# Altium schematic sheet 1_P1.schdoc
size 340 x 353 mm; Symbol: Sheet-Symbol_A4; Device: Sheet-Symbol_A4; Company: 嘉立创EDA; Version: V1.0; Page Size: A4; @Project Name: wheel_robot; @Page Count: 1; @Update Date: 2025-10-04; @Create Date: 2024-11-28; @Schematic Name: Schematic1; @Page No: 1; @Page Name: P1; @Board Name: CONTROL_STM32F407; @Create Time: 02:18:50; @Update Time: 21:44:46; Width: 1300; Height: 1350; Region Start: 1; X Region Count: 6; Y Region Count: 4; Blade Width: 10; Title Block Position: 3
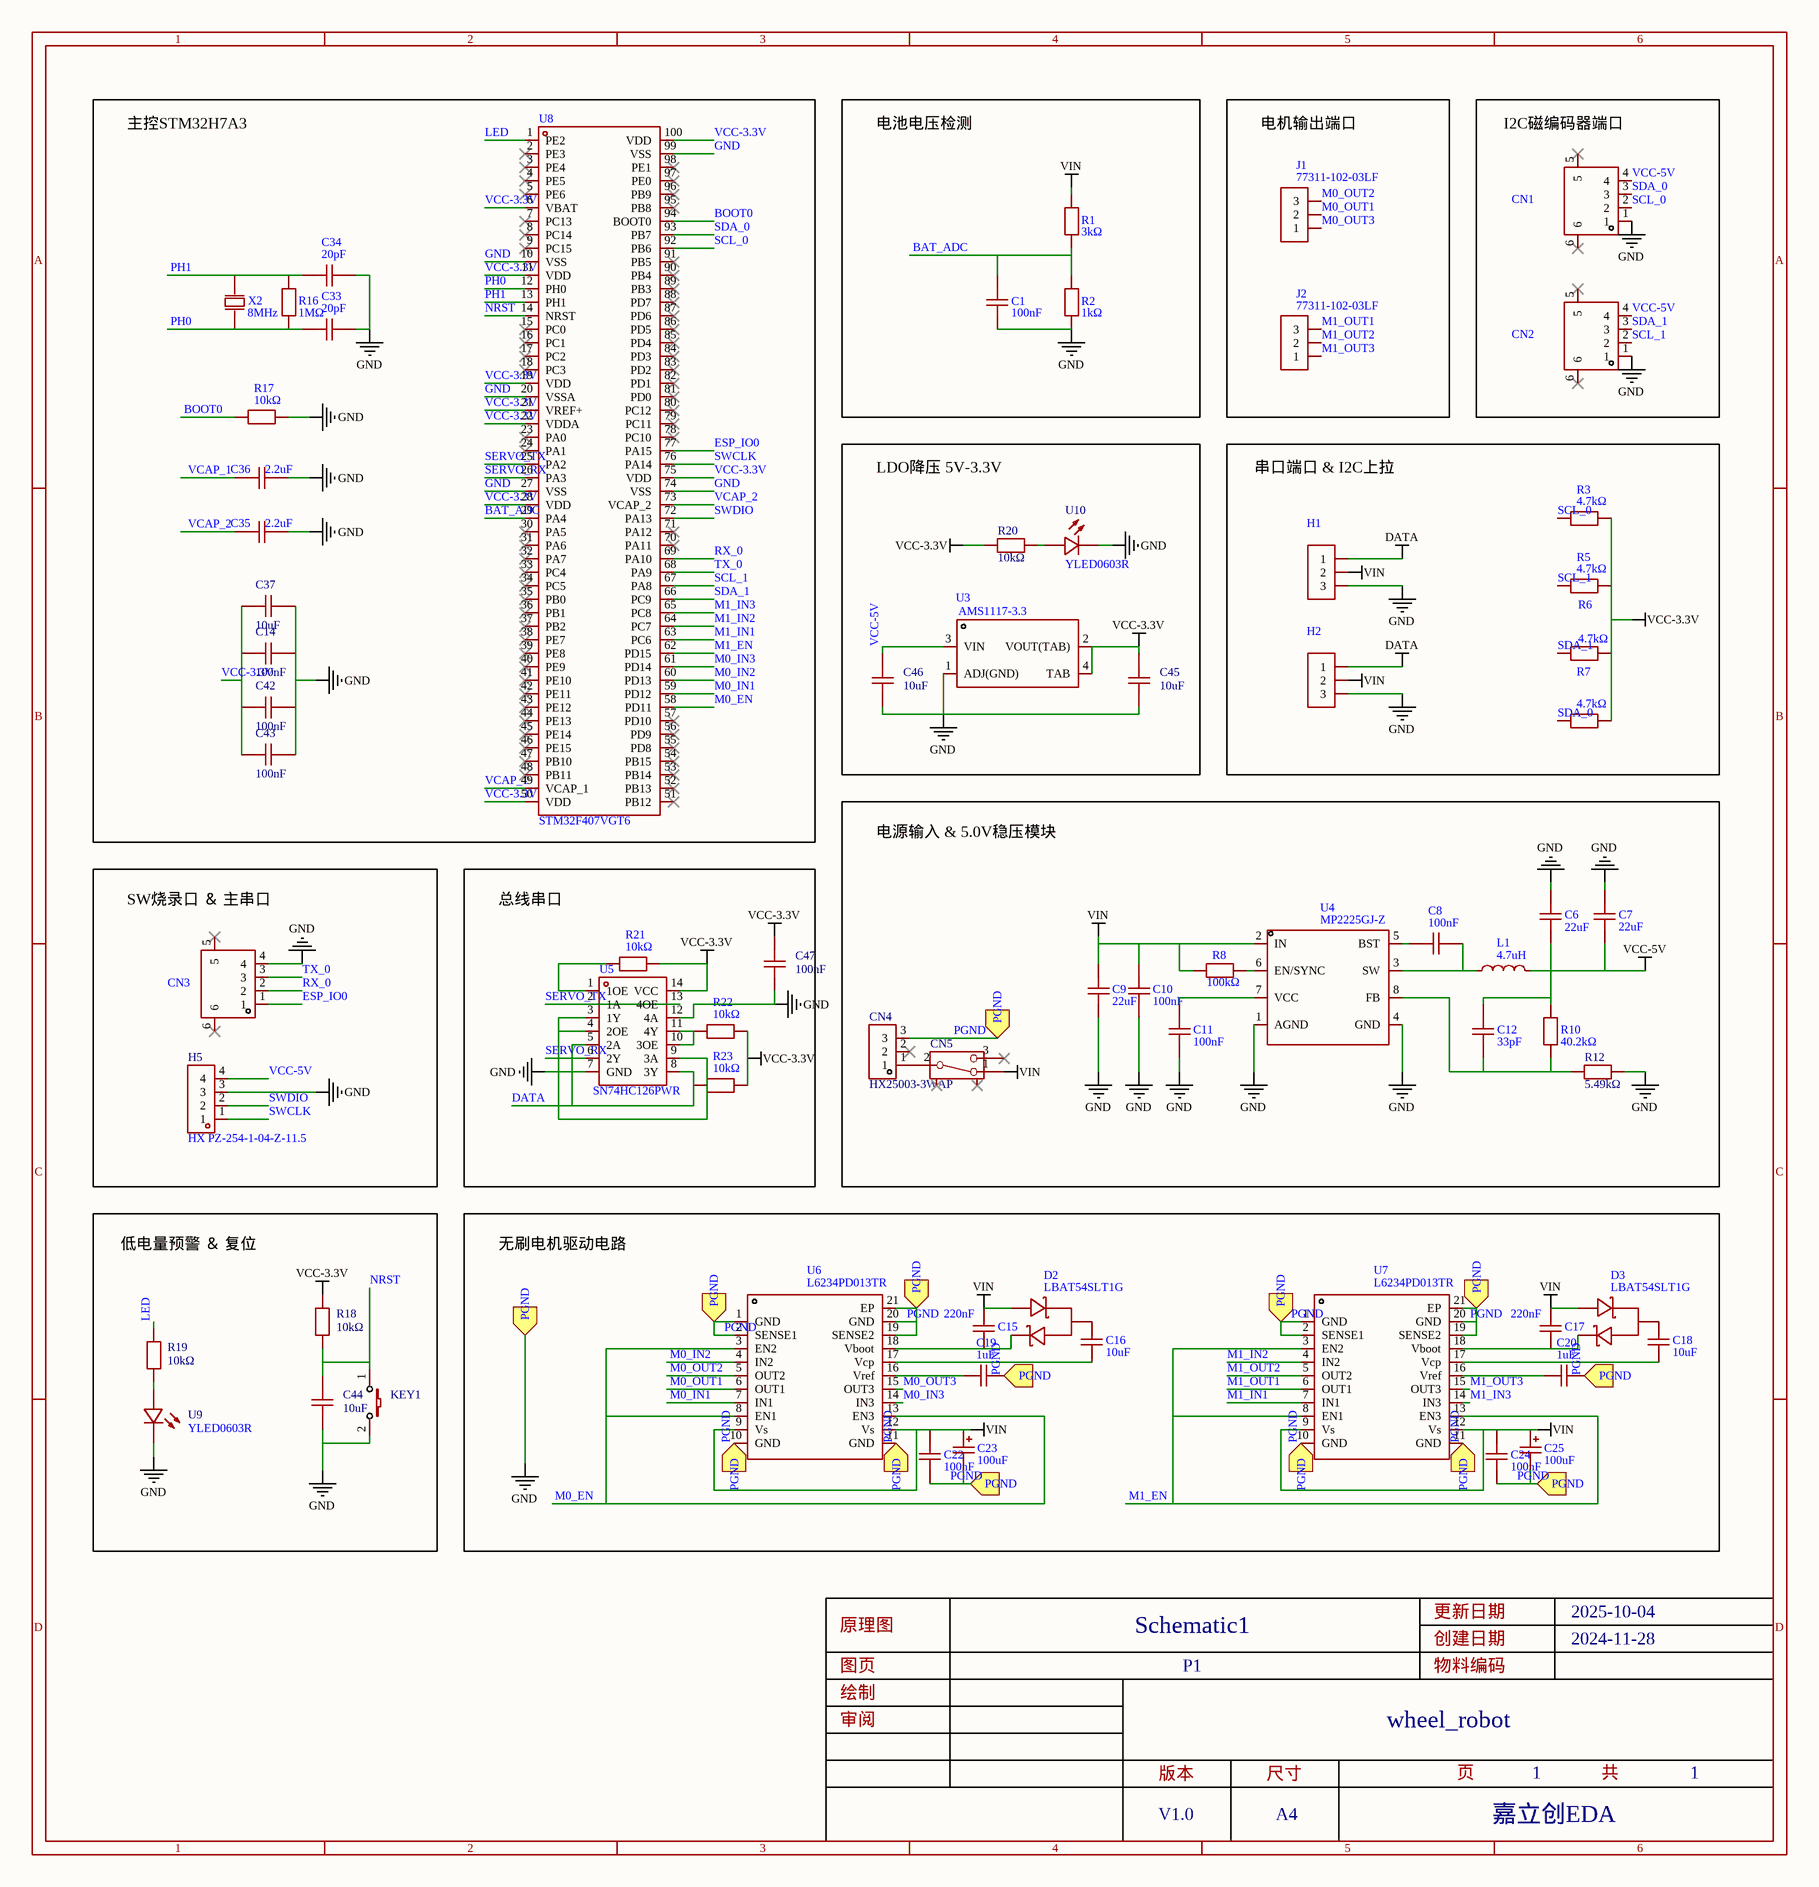
[diagram p0: 1_P1.schdoc]

## Parts
C1  100nF  [C0603]
C6  22uF  [C0603]
C7  22uF  [C0603]
C8  100nF  [C0603]
C9  22uF  [C0603]
C10  100nF  [C0603]
C11  100nF  [C0603]
C12  33pF  [C0603]
C14  100nF  [C0603]
C15  220nF  [C0603]
C16  10uF  [C0603]
C17  220nF  [C0603]
C18  10uF  [C0603]
C19  1uF  [C0603]
C20  1uF  [C0603]
C22  100nF  [C0603]
C23  100uF  [CAP-SMD_L7.3-W4.3-R-RD]
C24  100nF  [C0603]
C25  100uF  [CAP-SMD_L7.3-W4.3-R-RD]
C33  20pF  [C0603]
C34  20pF  [C0603]
C35  2.2uF  [C0603]
C36  2.2uF  [C0603]
C37  10uF  [C0603]
C42  100nF  [C0603]
C43  100nF  [C0603]
C44  10uF  [C0603]
C45  10uF  [C0603]
C46  10uF  [C0603]
C47  100nF  [C0603]
CN1  A1257WV-S-4P-LCP  [CONN-SMD_A1257WV-S-4P]  (value not drawn)
CN2  A1257WV-S-4P-LCP  [CONN-SMD_A1257WV-S-4P]  (value not drawn)
CN3  A1257WV-S-4P-LCP  [CONN-SMD_A1257WV-S-4P]  (value not drawn)
CN4  HX25003-3WAP  [CONN-TH_3P-P2.50_HX25003-3WAP]
CN5  SS-12D02-VG4  [SW-TH_SS-12D02-VG4]  (value not drawn)
D2  LBAT54SLT1G  [SOT-23_L2.9-W1.3-P1.90-LS2.4-BR]
D3  LBAT54SLT1G  [SOT-23_L2.9-W1.3-P1.90-LS2.4-BR]
H1  HC-5264-3AW  [CONN-TH_5264-3AW]  (value not drawn)
H2  HC-5264-3AW  [CONN-TH_5264-3AW]  (value not drawn)
H5  HX PZ-254-1-04-Z-11.5  [HDR-TH_4P-P2.54-V-M]
J1  77311-102-03LF  [HDR-M-2.54_1X3]
J2  77311-102-03LF  [HDR-M-2.54_1X3]
KEY1  K2-1107ST-A4DW-06  [KEY-SMD_2P-L6.2-W3.6-LS8.0]  (value not drawn)
L1  4.7uH  [IND-SMD_L7.3-W6.6]
R1  3kΩ  [R0603]
R2  1kΩ  [R0603]
R3  4.7kΩ  [R0603]
R5  4.7kΩ  [R0603]
R6  4.7kΩ  [R0603]
R7  4.7kΩ  [R0603]
R8  100kΩ  [R0603]
R10  40.2kΩ  [R0603]
R12  5.49kΩ  [R0603]
R16  1MΩ  [R0603]
R17  10kΩ  [R0603]
R18  10kΩ  [R0603]
R19  10kΩ  [R0603]
R20  10kΩ  [R0603]
R21  10kΩ  [R0603]
R22  10kΩ  [R0603]
R23  10kΩ  [R0603]
U3  AMS1117-3.3  [SOT-223_L6.7-W3.5-P2.30-BR]
U4  MP2225GJ-Z  [TSOT-23-8_L2.9-W1.6-P0.65-LS2.8-BR]
U5  SN74HC126PWR  [TSSOP-14_L5.0-W4.4-P0.65-LS6.4-BL]
U6  L6234PD013TR  [POWERSO20_L15.9-W11.0-P1.27-LS14.2-BL-EP]
U7  L6234PD013TR  [POWERSO20_L15.9-W11.0-P1.27-LS14.2-BL-EP]
U8  STM32F407VGT6  [LQFP-100_L14.0-W14.0-P0.50-LS16.0-BL]
U9  YLED0603R  [LED0603-FD]
U10  YLED0603R  [LED0603-FD]
X2  8MHz  [CRYSTAL-SMD_L5.0-W3.2]

## Blocks framed on the sheet
主控STM32H7A3: C14 C33-C37 C42 C43 R16 R17 U8 X2
电池电压检测: C1 R1 R2
电机输出端口: J1 J2
I2C磁编码器端口: CN1 CN2
LDO降压 5V-3.3V: C45 C46 R20 U3 U10
串口端口 & I2C上拉: H1 H2 R3 R5-R7
电源输入 & 5.0V稳压模块: C6-C12 CN4 CN5 L1 R8 R10 R12 U4
SW烧录口 ＆ 主串口: CN3 H5
总线串口: C47 R21-R23 U5
低电量预警 ＆ 复位: C44 KEY1 R18 R19 U9
无刷电机驱动电路: C15-C20 C22-C25 D2 D3 U6 U7

## Ports
PGND (in)

## Nets
DATA: H1.1 H2.1 R23.1 U5.5(2A) U5.8(3Y)
GND: C1.1 C6.1 C7.2 C9.1 C10.1 C11.1 C14.1 C19.2 C20.2 C22.1 C23.2 C24.1 C25.2 C33.2 C34.2 C35.2 C36.2 C37.1 C42.1 C43.1 C44.2 C45.2 C46.2 C47.2 CN1.1 CN2.1 CN3.4 CN4.3 H1.3 H2.3 H5.3 KEY1.2 R2.1 R12.1 R17.2 U3.1(ADJ(GND)) U4.1(AGND) U4.4(GND) U5.7(GND) U5.12(4A) U6.1(GND) U6.2(SENSE1) U6.10(GND) U6.11(GND) U6.19(SENSE2) U6.20(GND) U6.21(EP) U7.1(GND) U7.2(SENSE1) U7.10(GND) U7.11(GND) U7.19(SENSE2) U7.20(GND) U7.21(EP) U8.10(VSS) U8.20(VSSA) U8.27(VSS) U8.74(VSS) U8.99(VSS) U9.2(-) U10.2(-) ; port PGND  [also labelled PGND]
VCC-3.3V: C14.2 C37.2 C42.2 C43.2 C45.1 C47.1 R3.2 R5.2 R6.2 R7.2 R18.2 R20.2 R21.2 R22.2 R23.2 U3.2(VOUT(TAB)) U3.4(TAB) U5.14(VCC) U8.6(VBAT) U8.11(VDD) U8.19(VDD) U8.21(VREF+) U8.22(VDDA) U8.28(VDD) U8.50(VDD) U8.75(VDD) U8.100(VDD)
VCC-5V: C6.2 C7.1 C12.1 C46.1 CN1.4 CN2.4 H5.4 L1.2 R10.2 U3.3(VIN)
VIN: C9.2 C10.2 C15.1 C17.1 C22.2 C23.1 C24.2 C25.1 CN5.1 D2.1(A) D3.1(A) H1.2 H2.2 R1.2 R8.1 U4.2(IN) U6.9(Vs) U6.12(Vs) U7.9(Vs) U7.12(Vs)
BAT_ADC: C1.2 R1.1 R2.2 U8.29(PA4)
BOOT0: R17.1 U8.94(BOOT0)
ESP_IO0: CN3.1 U8.77(PA15)
LED: R19.2 U8.1(PE2)
M0_EN: U6.3(EN2) U6.8(EN1) U6.13(EN3) U8.58(PD11)
M0_IN1: U6.7(IN1) U8.59(PD12)
M0_IN2: U6.4(IN2) U8.60(PD13)
M0_IN3: U6.14(IN3) U8.61(PD14)
M0_OUT1: J1.2 U6.6(OUT1)
M0_OUT2: J1.3 U6.5(OUT2)
M0_OUT3: J1.1 U6.15(OUT3)
M1_EN: U7.3(EN2) U7.8(EN1) U7.13(EN3) U8.62(PD15)
M1_IN1: U7.7(IN1) U8.63(PC6)
M1_IN2: U7.4(IN2) U8.64(PC7)
M1_IN3: U7.14(IN3) U8.65(PC8)
M1_OUT1: J2.3 U7.6(OUT1)
M1_OUT2: J2.2 U7.5(OUT2)
M1_OUT3: J2.1 U7.15(OUT3)
NRST: C44.1 KEY1.1 R18.1 U8.14(NRST)
PH0: C33.1 R16.1 U8.12(PH0) X2.1(OSC1)
PH1: C34.1 R16.2 U8.13(PH1) X2.2(OSC2)
RX_0: CN3.2 U8.69(PA10)
SCL_0: CN1.2 R3.1 U8.92(PB6)
SCL_1: CN2.2 R5.1 U8.67(PA8)
SDA_0: CN1.3 R7.1 U8.93(PB7)
SDA_1: CN2.3 R6.1 U8.66(PC9)
SERVO_RX: U5.6(2Y) U8.26(PA3)
SERVO_TX: U5.2(1A) U5.13(4OE) U8.25(PA2)
SWCLK: H5.1 U8.76(PA14)
SWDIO: H5.2 U8.72(PA13)
TX_0: CN3.3 U8.68(PA9)
VCAP_1: C36.1 U8.49(VCAP_1)
VCAP_2: C35.1 U8.73(VCAP_2)
NetC8_1: C8.1 L1.1 U4.3(SW)
NetC8_2: C8.2 U4.5(BST)
NetC11_2: C11.2 U4.7(VCC)
NetC12_2: C12.2 R10.1 R12.2 U4.8(FB)
NetC15_2: C15.2 D2.2(K) U6.18(Vboot)
NetC16_1: C16.1 U6.17(Vcp)
NetC16_2: C16.2 D2.3(AK)
NetC17_2: C17.2 D3.2(K) U7.18(Vboot)
NetC18_1: C18.1 U7.17(Vcp)
NetC18_2: C18.2 D3.3(AK)
NetC19_1: C19.1 U6.16(Vref)
NetC20_1: C20.1 U7.16(Vref)
NetCN4_1: CN4.1 CN5.2
NetR8_2: R8.2 U4.6(EN/SYNC)
NetR19_1: R19.1 U9.1(+)
NetR20_1: R20.1 U10.1(+)
NetR21_1: R21.1 U5.1(1OE)
NetR22_1: R22.1 U5.10(3OE) U5.11(4Y)
NetU5_3: U5.3(1Y) U5.4(2OE) U5.9(3A)

Not connected (* = marked no-connect by the designer): CN1 5* 6*; CN2 5* 6*; CN3 5* 6*; CN4 2*; CN5 3* 4* 5*; U8 2(PE3)* 3(PE4)* 4(PE5)* 5(PE6)* 7(PC13)* 8(PC14)* 9(PC15)* 15(PC0)* 16(PC1)* 17(PC2)* 18(PC3)* 23(PA0)* 24(PA1)* 30(PA5)* 31(PA6)* 32(PA7)* 33(PC4)* 34(PC5)* 35(PB0)* 36(PB1)* 37(PB2)* 38(PE7)* 39(PE8)* 40(PE9)* 41(PE10)* 42(PE11)* 43(PE12)* 44(PE13)* 45(PE14)* 46(PE15)* 47(PB10)* 48(PB11)* 51(PB12)* 52(PB13)* 53(PB14)* 54(PB15)* 55(PD8)* 56(PD9)* 57(PD10)* 70(PA11)* 71(PA12)* 78(PC10)* 79(PC11)* 80(PC12)* 81(PD0)* 82(PD1)* 83(PD2)* 84(PD3)* 85(PD4)* 86(PD5)* 87(PD6)* 88(PD7)* 89(PB3)* 90(PB4)* 91(PB5)* 95(PB8)* 96(PB9)* 97(PE0)* 98(PE1)*

## Notes on the sheet
- 1
- 2
- 3
- 4
- 5
- 6
- A
- B
- C
- D
- 原理图
- Schematic1
- 创建日期
- 更新日期
- 2025-10-04
- 2024-11-28
- 绘制
- 图页
- P1
- 物料编码
- 审阅
- 版本
- 尺寸
- wheel_robot
- 页
- 共
- V1.0
- A4
- 嘉立创EDA

## Library data of the parts
C1 = CGA0603X7R104K500JT: Manufacturer: HRE(芯声); Symbol: 0.1uF; Add into BOM: yes; Tolerance: ±10%; Voltage Rated: 50V; Temperature Coefficient: X7R; Channel ID: $1e1331; Device: CGA0603X7R104K500JT; LCSC Part Name: 100nF ±10% 50V; Supplier Part: C6119867; Manufacturer Part: CGA0603X7R104K500JT; Supplier Footprint: 0603; JLCPCB Part Class: Extended Part; Supplier: LCSC; Convert to PCB: yes; Value: 100nF; FootprintName: C0603; DeviceName: CGA0603X7R104K500JT
C6 = CGA0603X5R226M160JT: Manufacturer: HRE(芯声); Add into BOM: yes; Tolerance: ±20%; Voltage Rating: 16V; Temperature Coefficient: X5R; Channel ID: $1e2697; Symbol: 22uF; Device: CGA0603X5R226M160JT; LCSC Part Name: 22uF ±20% 16V; Supplier Part: C6119868; Manufacturer Part: CGA0603X5R226M160JT; Supplier Footprint: 0603; JLCPCB Part Class: Extended Part; Datasheet: https://atta.szlcsc.com/upload/public/pdf/source/20250121/36E435B8815E1026A710792D223DB526.pdf; Supplier: LCSC; Convert to PCB: yes; Value: 22uF; FootprintName: C0603; DeviceName: CGA0603X5R226M160JT
C7 = CGA0603X5R226M160JT: Manufacturer: HRE(芯声); Add into BOM: yes; Tolerance: ±20%; Voltage Rating: 16V; Temperature Coefficient: X5R; Channel ID: $1e2759; Symbol: 22uF; Device: CGA0603X5R226M160JT; LCSC Part Name: 22uF ±20% 16V; Supplier Part: C6119868; Manufacturer Part: CGA0603X5R226M160JT; Supplier Footprint: 0603; JLCPCB Part Class: Extended Part; Datasheet: https://atta.szlcsc.com/upload/public/pdf/source/20250121/36E435B8815E1026A710792D223DB526.pdf; Supplier: LCSC; Convert to PCB: yes; Value: 22uF; FootprintName: C0603; DeviceName: CGA0603X5R226M160JT
C8 = CGA0603X7R104K500JT: Manufacturer: HRE(芯声); Symbol: 0.1uF; Add into BOM: yes; Tolerance: ±10%; Voltage Rated: 50V; Temperature Coefficient: X7R; Channel ID: $1e2723; Device: CGA0603X7R104K500JT; LCSC Part Name: 100nF ±10% 50V; Supplier Part: C6119867; Manufacturer Part: CGA0603X7R104K500JT; Supplier Footprint: 0603; JLCPCB Part Class: Extended Part; Supplier: LCSC; Convert to PCB: yes; Value: 100nF; FootprintName: C0603; DeviceName: CGA0603X7R104K500JT
C9 = CGA0603X5R226M160JT: Manufacturer: HRE(芯声); Add into BOM: yes; Tolerance: ±20%; Voltage Rating: 16V; Temperature Coefficient: X5R; Channel ID: $1e2569; Symbol: 22uF; Device: CGA0603X5R226M160JT; LCSC Part Name: 22uF ±20% 16V; Supplier Part: C6119868; Manufacturer Part: CGA0603X5R226M160JT; Supplier Footprint: 0603; JLCPCB Part Class: Extended Part; Datasheet: https://atta.szlcsc.com/upload/public/pdf/source/20250121/36E435B8815E1026A710792D223DB526.pdf; Supplier: LCSC; Convert to PCB: yes; Value: 22uF; FootprintName: C0603; DeviceName: CGA0603X5R226M160JT
C10 = CGA0603X7R104K500JT: Manufacturer: HRE(芯声); Symbol: 0.1uF; Add into BOM: yes; Tolerance: ±10%; Voltage Rated: 50V; Temperature Coefficient: X7R; Channel ID: $1e2595; Device: CGA0603X7R104K500JT; LCSC Part Name: 100nF ±10% 50V; Supplier Part: C6119867; Manufacturer Part: CGA0603X7R104K500JT; Supplier Footprint: 0603; JLCPCB Part Class: Extended Part; Supplier: LCSC; Convert to PCB: yes; Value: 100nF; FootprintName: C0603; DeviceName: CGA0603X7R104K500JT
C11 = CGA0603X7R104K500JT: Manufacturer: HRE(芯声); Symbol: 0.1uF; Add into BOM: yes; Tolerance: ±10%; Voltage Rated: 50V; Temperature Coefficient: X7R; Channel ID: $1e2641; Device: CGA0603X7R104K500JT; LCSC Part Name: 100nF ±10% 50V; Supplier Part: C6119867; Manufacturer Part: CGA0603X7R104K500JT; Supplier Footprint: 0603; JLCPCB Part Class: Extended Part; Supplier: LCSC; Convert to PCB: yes; Value: 100nF; FootprintName: C0603; DeviceName: CGA0603X7R104K500JT
C12 = CL10C330JB8NNNC: Manufacturer: SAMSUNG(三星); Add into BOM: yes; Tolerance: ±5%; Voltage Rated: 50V; Temperature Coefficient: C0G; Channel ID: $1e2805; Symbol: 33pF; Device: CL10C330JB8NNNC; LCSC Part Name: 33pF ±5% 50V; Supplier Part: C1663; Manufacturer Part: CL10C330JB8NNNC; Supplier Footprint: 0603; JLCPCB Part Class: Basic Part; Datasheet: https://atta.szlcsc.com/upload/public/pdf/source/20160218/1457707763339.pdf; Supplier: LCSC; Convert to PCB: yes; Value: 33pF; FootprintName: C0603; DeviceName: CL10C330JB8NNNC
C14 = CGA0603X7R104K500JT: Manufacturer: HRE(芯声); Symbol: 0.1u; Add into BOM: yes; Tolerance: ±10%; Voltage Rated: 50V; Temperature Coefficient: X7R; Channel ID: $1e29867; Device: CGA0603X7R104K500JT; LCSC Part Name: 100nF ±10% 50V; Supplier Part: C6119867; Manufacturer Part: CGA0603X7R104K500JT; Supplier Footprint: 0603; JLCPCB Part Class: Extended Part; Supplier: LCSC; Convert to PCB: yes; Value: 100nF; FootprintName: C0603; DeviceName: CGA0603X7R104K500JT
C15 = CL10B224KA8NNNC: Manufacturer: SAMSUNG(三星); Add into BOM: yes; Tolerance: ±10%; Voltage Rated: 25V; Temperature Coefficient: X7R; Channel ID: $1e1890; Symbol: 220nF; Device: CL10B224KA8NNNC; LCSC Part Name: 220nF ±10% 25V; Supplier Part: C21120; Manufacturer Part: CL10B224KA8NNNC; Supplier Footprint: 0603; JLCPCB Part Class: Basic Part; Datasheet: https://atta.szlcsc.com/upload/public/pdf/source/20160218/1457707763339.pdf; Supplier: LCSC; Convert to PCB: yes; Value: 220nF; FootprintName: C0603; DeviceName: CL10B224KA8NNNC
C16 = CGA0603X5R106K100JT: Manufacturer: HRE(芯声); Symbol: 10nF; Add into BOM: yes; Tolerance: ±10%; Voltage Rated: 10V; Temperature Coefficient: X5R; Channel ID: $1e1853; Device: CGA0603X5R106K100JT; LCSC Part Name: 10uF ±10% 10V; Supplier Part: C6119842; Manufacturer Part: CGA0603X5R106K100JT; Supplier Footprint: 0603; JLCPCB Part Class: Extended Part; Supplier: LCSC; Convert to PCB: yes; Value: 10uF; FootprintName: C0603; DeviceName: CGA0603X5R106K100JT
C17 = CL10B224KA8NNNC: Manufacturer: SAMSUNG(三星); Add into BOM: yes; Tolerance: ±10%; Voltage Rated: 25V; Temperature Coefficient: X7R; Channel ID: $1e1927; Symbol: 220nF; Device: CL10B224KA8NNNC; LCSC Part Name: 220nF ±10% 25V; Supplier Part: C21120; Manufacturer Part: CL10B224KA8NNNC; Supplier Footprint: 0603; JLCPCB Part Class: Basic Part; Datasheet: https://atta.szlcsc.com/upload/public/pdf/source/20160218/1457707763339.pdf; Supplier: LCSC; Convert to PCB: yes; Value: 220nF; FootprintName: C0603; DeviceName: CL10B224KA8NNNC
C18 = CGA0603X5R106K100JT: Manufacturer: HRE(芯声); Symbol: 10nF; Add into BOM: yes; Tolerance: ±10%; Voltage Rated: 10V; Temperature Coefficient: X5R; Channel ID: $1e1986; Device: CGA0603X5R106K100JT; LCSC Part Name: 10uF ±10% 10V; Supplier Part: C6119842; Manufacturer Part: CGA0603X5R106K100JT; Supplier Footprint: 0603; JLCPCB Part Class: Extended Part; Supplier: LCSC; Convert to PCB: yes; Value: 10uF; FootprintName: C0603; DeviceName: CGA0603X5R106K100JT
C19 = CGA0603X5R105K500JT: Manufacturer: HRE(芯声); Add into BOM: yes; Tolerance: ±10%; Voltage Rating: 50V; Temperature Coefficient: X5R; Channel ID: $1e1757; Symbol: 1uF; Device: CGA0603X5R105K500JT; LCSC Part Name: 1uF ±10% 50V; Supplier Part: C6119852; Manufacturer Part: CGA0603X5R105K500JT; Supplier Footprint: 0603; JLCPCB Part Class: Extended Part; Supplier: LCSC; Convert to PCB: yes; Value: 1uF; FootprintName: C0603; DeviceName: CGA0603X5R105K500JT
C20 = CGA0603X5R105K500JT: Manufacturer: HRE(芯声); Add into BOM: yes; Tolerance: ±10%; Voltage Rating: 50V; Temperature Coefficient: X5R; Channel ID: $1e1784; Symbol: 1uF; Device: CGA0603X5R105K500JT; LCSC Part Name: 1uF ±10% 50V; Supplier Part: C6119852; Manufacturer Part: CGA0603X5R105K500JT; Supplier Footprint: 0603; JLCPCB Part Class: Extended Part; Supplier: LCSC; Convert to PCB: yes; Value: 1uF; FootprintName: C0603; DeviceName: CGA0603X5R105K500JT
C22 = CGA0603X7R104K500JT: Manufacturer: HRE(芯声); Add into BOM: yes; Tolerance: ±10%; Voltage Rated: 50V; Temperature Coefficient: X7R; Channel ID: $1e2131; Symbol: 100nF; Device: CGA0603X7R104K500JT; LCSC Part Name: 100nF ±10% 50V; Supplier Part: C6119867; Manufacturer Part: CGA0603X7R104K500JT; Supplier Footprint: 0603; JLCPCB Part Class: Extended Part; Supplier: LCSC; Convert to PCB: yes; Value: 100nF; FootprintName: C0603; DeviceName: CGA0603X7R104K500JT
C23 = TAJD107M020RNJ: Manufacturer: Kyocera AVX; Add into BOM: yes; Tolerance: ±20%; Rated Voltage: 20V; Equivalent Series Resistance(ESR): 500mΩ@100kHz; Channel ID: $1e2285; Symbol: 100uF; Device: TAJD107M020RNJ; LCSC Part Name: 100uF ±20% 20V; Supplier Part: C99373; Manufacturer Part: TAJD107M020RNJ; Supplier Footprint: CASE-D-7343; JLCPCB Part Class: Extended Part; Datasheet: https://atta.szlcsc.com/upload/public/pdf/source/20180227/C182558_15197019548181370714.pdf; Supplier: LCSC; Convert to PCB: yes; Value: 100uF; Operating Temperature: -55℃~+125℃; FootprintName: CAP-SMD_L7.3-W4.3-R-RD; DeviceName: TAJD107M020RNJ
C24 = CGA0603X7R104K500JT: Manufacturer: HRE(芯声); Add into BOM: yes; Tolerance: ±10%; Voltage Rated: 50V; Temperature Coefficient: X7R; Channel ID: $1e2158; Symbol: 100nF; Device: CGA0603X7R104K500JT; LCSC Part Name: 100nF ±10% 50V; Supplier Part: C6119867; Manufacturer Part: CGA0603X7R104K500JT; Supplier Footprint: 0603; JLCPCB Part Class: Extended Part; Supplier: LCSC; Convert to PCB: yes; Value: 100nF; FootprintName: C0603; DeviceName: CGA0603X7R104K500JT
C25 = TAJD107M020RNJ: Manufacturer: Kyocera AVX; Add into BOM: yes; Tolerance: ±20%; Rated Voltage: 20V; Equivalent Series Resistance(ESR): 500mΩ@100kHz; Channel ID: $1e2312; Symbol: 100uF; Device: TAJD107M020RNJ; LCSC Part Name: 100uF ±20% 20V; Supplier Part: C99373; Manufacturer Part: TAJD107M020RNJ; Supplier Footprint: CASE-D-7343; JLCPCB Part Class: Extended Part; Datasheet: https://atta.szlcsc.com/upload/public/pdf/source/20180227/C182558_15197019548181370714.pdf; Supplier: LCSC; Convert to PCB: yes; Value: 100uF; Operating Temperature: -55℃~+125℃; FootprintName: CAP-SMD_L7.3-W4.3-R-RD; DeviceName: TAJD107M020RNJ
C33 = CC0603JRNPO9BN200: Manufacturer: YAGEO(国巨); Symbol: 20p; Add into BOM: yes; Tolerance: ±5%; Voltage Rated: 50V; Temperature Coefficient: NP0; Channel ID: $1e29413; Device: CC0603JRNPO9BN200; LCSC Part Name: 20pF ±5% 50V; Supplier Part: C105621; Manufacturer Part: CC0603JRNPO9BN200; Supplier Footprint: 0603; JLCPCB Part Class: Extended Part; Datasheet: https://atta.szlcsc.com/upload/public/pdf/source/20170505/1493957838062.pdf; Supplier: LCSC; Convert to PCB: yes; Value: 20pF; FootprintName: C0603; DeviceName: CC0603JRNPO9BN200
C34 = CC0603JRNPO9BN200: Manufacturer: YAGEO(国巨); Symbol: 20p; Add into BOM: yes; Tolerance: ±5%; Voltage Rated: 50V; Temperature Coefficient: NP0; Channel ID: $1e29436; Device: CC0603JRNPO9BN200; LCSC Part Name: 20pF ±5% 50V; Supplier Part: C105621; Manufacturer Part: CC0603JRNPO9BN200; Supplier Footprint: 0603; JLCPCB Part Class: Extended Part; Datasheet: https://atta.szlcsc.com/upload/public/pdf/source/20170505/1493957838062.pdf; Supplier: LCSC; Convert to PCB: yes; Value: 20pF; FootprintName: C0603; DeviceName: CC0603JRNPO9BN200
C35 = CL10A225KB8NNNC: Manufacturer: SAMSUNG(三星); Symbol: 10u; Add into BOM: yes; Tolerance: ±10%; Voltage Rated: 50V; Temperature Coefficient: X5R; Channel ID: $1e29770; Device: CL10A225KB8NNNC; LCSC Part Name: 2.2uF ±10% 50V; Supplier Part: C913904; Manufacturer Part: CL10A225KB8NNNC; Supplier Footprint: 0603; JLCPCB Part Class: Extended Part; Datasheet: https://atta.szlcsc.com/upload/public/pdf/source/20160218/1457707763339.pdf; Supplier: LCSC; Convert to PCB: yes; Value: 2.2uF; FootprintName: C0603; DeviceName: CL10A225KB8NNNC
C36 = CL10A225KB8NNNC: Manufacturer: SAMSUNG(三星); Symbol: 10u; Add into BOM: yes; Tolerance: ±10%; Voltage Rated: 50V; Temperature Coefficient: X5R; Channel ID: $1e29793; Device: CL10A225KB8NNNC; LCSC Part Name: 2.2uF ±10% 50V; Supplier Part: C913904; Manufacturer Part: CL10A225KB8NNNC; Supplier Footprint: 0603; JLCPCB Part Class: Extended Part; Datasheet: https://atta.szlcsc.com/upload/public/pdf/source/20160218/1457707763339.pdf; Supplier: LCSC; Convert to PCB: yes; Value: 2.2uF; FootprintName: C0603; DeviceName: CL10A225KB8NNNC
C37 = CGA0603X5R106K100JT: Manufacturer: HRE(芯声); Symbol: 10u; Add into BOM: yes; Tolerance: ±10%; Voltage Rated: 10V; Temperature Coefficient: X5R; Channel ID: $1e29824; Device: CGA0603X5R106K100JT; LCSC Part Name: 10uF ±10% 10V; Supplier Part: C6119842; Manufacturer Part: CGA0603X5R106K100JT; Supplier Footprint: 0603; JLCPCB Part Class: Extended Part; Supplier: LCSC; Convert to PCB: yes; Value: 10uF; FootprintName: C0603; DeviceName: CGA0603X5R106K100JT
C42 = CGA0603X7R104K500JT: Manufacturer: HRE(芯声); Symbol: 0.1u; Add into BOM: yes; Tolerance: ±10%; Voltage Rated: 50V; Temperature Coefficient: X7R; Channel ID: $1e29982; Device: CGA0603X7R104K500JT; LCSC Part Name: 100nF ±10% 50V; Supplier Part: C6119867; Manufacturer Part: CGA0603X7R104K500JT; Supplier Footprint: 0603; JLCPCB Part Class: Extended Part; Supplier: LCSC; Convert to PCB: yes; Value: 100nF; FootprintName: C0603; DeviceName: CGA0603X7R104K500JT
C43 = CGA0603X7R104K500JT: Manufacturer: HRE(芯声); Symbol: 0.1u; Add into BOM: yes; Tolerance: ±10%; Voltage Rated: 50V; Temperature Coefficient: X7R; Channel ID: $1e30005; Device: CGA0603X7R104K500JT; LCSC Part Name: 100nF ±10% 50V; Supplier Part: C6119867; Manufacturer Part: CGA0603X7R104K500JT; Supplier Footprint: 0603; JLCPCB Part Class: Extended Part; Supplier: LCSC; Convert to PCB: yes; Value: 100nF; FootprintName: C0603; DeviceName: CGA0603X7R104K500JT
C44 = CGA0603X5R106K100JT: Manufacturer: HRE(芯声); Symbol: 10u; Add into BOM: yes; Tolerance: ±10%; Voltage Rated: 10V; Temperature Coefficient: X5R; Channel ID: $1e30419; Device: CGA0603X5R106K100JT; LCSC Part Name: 10uF ±10% 10V; Supplier Part: C6119842; Manufacturer Part: CGA0603X5R106K100JT; Supplier Footprint: 0603; JLCPCB Part Class: Extended Part; Supplier: LCSC; Convert to PCB: yes; Value: 10uF; FootprintName: C0603; DeviceName: CGA0603X5R106K100JT
C45 = CGA0603X5R106K100JT: Manufacturer: HRE(芯声); Symbol: 10u; Add into BOM: yes; Tolerance: ±10%; Voltage Rated: 10V; Temperature Coefficient: X5R; Channel ID: $1e30669; Device: CGA0603X5R106K100JT; LCSC Part Name: 10uF ±10% 10V; Supplier Part: C6119842; Manufacturer Part: CGA0603X5R106K100JT; Supplier Footprint: 0603; JLCPCB Part Class: Extended Part; Supplier: LCSC; Convert to PCB: yes; Value: 10uF; FootprintName: C0603; DeviceName: CGA0603X5R106K100JT
C46 = CGA0603X5R106K100JT: Manufacturer: HRE(芯声); Symbol: 10u; Add into BOM: yes; Tolerance: ±10%; Voltage Rated: 10V; Temperature Coefficient: X5R; Channel ID: $1e30692; Device: CGA0603X5R106K100JT; LCSC Part Name: 10uF ±10% 10V; Supplier Part: C6119842; Manufacturer Part: CGA0603X5R106K100JT; Supplier Footprint: 0603; JLCPCB Part Class: Extended Part; Supplier: LCSC; Convert to PCB: yes; Value: 10uF; FootprintName: C0603; DeviceName: CGA0603X5R106K100JT
C47 = CGA0603X7R104K500JT: Manufacturer: HRE(芯声); Symbol: 0.1u; Add into BOM: yes; Tolerance: ±10%; Voltage Rated: 50V; Temperature Coefficient: X7R; Channel ID: $1e30860; Device: CGA0603X7R104K500JT; LCSC Part Name: 100nF ±10% 50V; Supplier Part: C6119867; Manufacturer Part: CGA0603X7R104K500JT; Supplier Footprint: 0603; JLCPCB Part Class: Extended Part; Supplier: LCSC; Convert to PCB: yes; Value: 100nF; FootprintName: C0603; DeviceName: CGA0603X7R104K500JT
CN1 = A1257WV-S-4P-LCP: Manufacturer: CJT(长江连接器); Add into BOM: yes; Pins Structure: 1x4P; Pitch: 1.25mm; Reference Series: GH; Number of PINs Per Row: 4; Channel ID: $1e1149; Symbol: A1257WV-S-4P; Device: A1257WV-S-4P-LCP; LCSC Part Name: 系列:GH 间距:1.25mm 1x4P; Supplier Part: C225120; Manufacturer Part: A1257WV-S-4P-LCP; Supplier Footprint: SMD,P=1.25mm; JLCPCB Part Class: Extended Part; Datasheet: https://atta.szlcsc.com/upload/public/pdf/source/20181008/C272994_C9E89FA8A36D0009CAD30AD8C59C2782.pdf; Supplier: LCSC; Convert to PCB: yes; Mounting Style: -; Number of Pins: 4P; Number of Rows: 1; Row Spacing: -; Contact Material: 黄铜; FootprintName: CONN-SMD_A1257WV-S-4P; DeviceName: A1257WV-S-4P-LCP
CN2 = A1257WV-S-4P-LCP: Manufacturer: CJT(长江连接器); Add into BOM: yes; Pins Structure: 1x4P; Pitch: 1.25mm; Reference Series: GH; Number of PINs Per Row: 4; Channel ID: $1e1190; Symbol: A1257WV-S-4P; Device: A1257WV-S-4P-LCP; LCSC Part Name: 系列:GH 间距:1.25mm 1x4P; Supplier Part: C225120; Manufacturer Part: A1257WV-S-4P-LCP; Supplier Footprint: SMD,P=1.25mm; JLCPCB Part Class: Extended Part; Datasheet: https://atta.szlcsc.com/upload/public/pdf/source/20181008/C272994_C9E89FA8A36D0009CAD30AD8C59C2782.pdf; Supplier: LCSC; Convert to PCB: yes; Mounting Style: -; Number of Pins: 4P; Number of Rows: 1; Row Spacing: -; Contact Material: 黄铜; FootprintName: CONN-SMD_A1257WV-S-4P; DeviceName: A1257WV-S-4P-LCP
CN3 = A1257WV-S-4P-LCP: Manufacturer: CJT(长江连接器); Add into BOM: yes; Pins Structure: 1x4P; Pitch: 1.25mm; Reference Series: GH; Number of PINs Per Row: 4; Channel ID: $1e19136; Symbol: A1257WV-S-4P; Device: A1257WV-S-4P-LCP; LCSC Part Name: 系列:GH 间距:1.25mm 1x4P; Supplier Part: C225120; Manufacturer Part: A1257WV-S-4P-LCP; Supplier Footprint: SMD,P=1.25mm; JLCPCB Part Class: Extended Part; Datasheet: https://atta.szlcsc.com/upload/public/pdf/source/20181008/C272994_C9E89FA8A36D0009CAD30AD8C59C2782.pdf; Supplier: LCSC; Convert to PCB: yes; Mounting Style: -; Number of Pins: 4P; Number of Rows: 1; Row Spacing: -; Contact Material: 黄铜; Origin Footprint: CONN-SMD_A1257WV-S-4P; FootprintName: CONN-SMD_A1257WV-S-4P; DeviceName: A1257WV-S-4P-LCP
CN4 = HX25003-3WAP: Manufacturer: HX(红星); Add into BOM: yes; Symbol: HX25003-3WAP; Device: HX25003-3WAP; Supplier: LCSC; Supplier Part: C442327; Manufacturer Part: HX25003-3WAP; JLCPCB Part Class: Extended Part; Convert to PCB: yes; Origin Footprint: CONN-TH_3P-P2.50_HX25003-3WAP
CN5 = SS-12D02-VG4_C136719: Manufacturer: 韩国韩荣; Add into BOM: yes; Circuit: 单刀双掷; Actuator Style: 矩形柱状; Pin Style: PC引脚; Switch Height: 8.7mm; Mechanical Life: 5千次; Channel ID: $1e3504; Symbol: SS-12D02-VG4; Device: SS-12D02-VG4_C136719; LCSC Part Name: 直插双档 滑动开关; Supplier Part: C136719; Manufacturer Part: SS-12D02-VG4; Supplier Footprint: 插件; JLCPCB Part Class: Extended Part; Datasheet: https://atta.szlcsc.com/upload/public/pdf/source/20171030/C136719_15093664985151068208.pdf; Supplier: LCSC; Convert to PCB: yes; Mounting Style: 直插; Current Rating (DC): -; Voltage Rating (DC): -; Current Rating (AC): -; Voltage Rating (AC): -; Operating Temperature: -25℃~+70℃; FootprintName: SW-TH_SS-12D02-VG4; DeviceName: SS-12D02-VG4_C136719
D2 = LBAT54SLT1G: Manufacturer: LRC(乐山无线电); Add into BOM: yes; Forward Voltage (Vf@If): 400mV; Reverse Voltage (Vr): 30V; Average Rectified Current (Io): 200mA; Reverse Leakage Current (Ir): 2uA; Channel ID: $1e1821; Symbol: LBAT54SLT1G; Device: LBAT54SLT1G; LCSC Part Name: 电压:30V 电流:200mA; Supplier Part: C12765; Manufacturer Part: LBAT54SLT1G; Supplier Footprint: SOT-23; JLCPCB Part Class: Extended Part; Datasheet: https://atta.szlcsc.com/upload/public/pdf/source/20130604/1457706606553.pdf; Supplier: LCSC; Convert to PCB: yes; FootprintName: SOT-23_L2.9-W1.3-P1.90-LS2.4-BR; DeviceName: LBAT54SLT1G
D3 = LBAT54SLT1G: Manufacturer: LRC(乐山无线电); Add into BOM: yes; Forward Voltage (Vf@If): 400mV; Reverse Voltage (Vr): 30V; Average Rectified Current (Io): 200mA; Reverse Leakage Current (Ir): 2uA; Channel ID: $1e1954; Symbol: LBAT54SLT1G; Device: LBAT54SLT1G; LCSC Part Name: 电压:30V 电流:200mA; Supplier Part: C12765; Manufacturer Part: LBAT54SLT1G; Supplier Footprint: SOT-23; JLCPCB Part Class: Extended Part; Datasheet: https://atta.szlcsc.com/upload/public/pdf/source/20130604/1457706606553.pdf; Supplier: LCSC; Convert to PCB: yes; FootprintName: SOT-23_L2.9-W1.3-P1.90-LS2.4-BR; DeviceName: LBAT54SLT1G
H1 = HC-5264-3AW: Manufacturer: HCTL(华灿天禄); Add into BOM: yes; Pins Structure: 1x3P; Pitch: 2.5mm; Reference Series: Mini-SPOX(5264); Number of PINs Per Row: 3; Current Rating (Max): 3A; Rated Voltage (Max): 250V; Plastic Material: PA66; Flame Retardant Rating: UL94V-0; Z-Height of the Board: 4.9mm; X-Length of Bottom Edge on Board (Spacing Line): 10mm; Y-Width of Bottom Edge on Board: 8mm; Channel ID: $1e3562; Standardization Check: false; Symbol: 5264-3A; Device: HC-5264-3AW; LCSC Part Name: 1x3P 间距:2.5mm 弯插 系列:Mini-SPOX(5264); Supplier Part: C2845826; Manufacturer Part: HC-5264-3AW; Supplier Footprint: 弯插,P=2.5mm; JLCPCB Part Class: Extended Part; Datasheet: https://atta.szlcsc.com/upload/public/pdf/source/20231019/7C36622803850C43F3C11A8612AA539D.pdf; Supplier: LCSC; Convert to PCB: yes; Mounting Style: 弯插; Number of Pins: 3P; Number of Rows: 1; Row Spacing: -; Contact Material: 黄铜; Contact Plating: 锡; Operating Temperature Range: -25℃~+85℃; Supplementary Features: -; Colour: -; FootprintName: CONN-TH_5264-3AW; DeviceName: HC-5264-3AW
H2 = HC-5264-3AW: Manufacturer: HCTL(华灿天禄); Add into BOM: yes; Pins Structure: 1x3P; Pitch: 2.5mm; Reference Series: Mini-SPOX(5264); Number of PINs Per Row: 3; Current Rating (Max): 3A; Rated Voltage (Max): 250V; Plastic Material: PA66; Flame Retardant Rating: UL94V-0; Z-Height of the Board: 4.9mm; X-Length of Bottom Edge on Board (Spacing Line): 10mm; Y-Width of Bottom Edge on Board: 8mm; Channel ID: $1e3612; Standardization Check: false; Symbol: 5264-3A; Device: HC-5264-3AW; LCSC Part Name: 1x3P 间距:2.5mm 弯插 系列:Mini-SPOX(5264); Supplier Part: C2845826; Manufacturer Part: HC-5264-3AW; Supplier Footprint: 弯插,P=2.5mm; JLCPCB Part Class: Extended Part; Datasheet: https://atta.szlcsc.com/upload/public/pdf/source/20231019/7C36622803850C43F3C11A8612AA539D.pdf; Supplier: LCSC; Convert to PCB: yes; Mounting Style: 弯插; Number of Pins: 3P; Number of Rows: 1; Row Spacing: -; Contact Material: 黄铜; Contact Plating: 锡; Operating Temperature Range: -25℃~+85℃; Supplementary Features: -; Colour: -; FootprintName: CONN-TH_5264-3AW; DeviceName: HC-5264-3AW
H5 = HX PZ-254-1-04-Z-11.5: Manufacturer: hanxia(韩下); Add into BOM: yes; Pin Structure: 1x4P; Pitch: 2.54mm; Circluar Pins/Square Pins: 方针; Current Rating (Max): 3A; Symbol: HX PZ-254-1-04-Z-11.5; Device: HX PZ-254-1-04-Z-11.5; LCSC Part Name: 2.54-1*4P直针公头 总高11.5 配套排母：HX PM2.54-1x4P系列; Supplier Part: C42391538; Manufacturer Part: HX PZ-254-1-04-Z-11.5; Supplier Footprint: 插件,P=2.54mm; Datasheet: https://atta.szlcsc.com/upload/public/pdf/source/20241120/7217712C20D40EE205DB74371EFB8B78.pdf; Supplier: LCSC; Convert to PCB: yes; Row Spacing: -; Mounting Type: 直插; Number of Rows: 单排; Number of Pins: 4P; Length of Mating Pin: 6mm; Insulation Height: 2.5mm; Length of End Connection Pin: 3mm; Contact Plating: 金; Operating Temperature Range: -40℃~+105℃; Color: 黑色
J1 = 77311-102-03LF: Manufacturer: Amphenol; Add into BOM: yes; Pitch: 2.54mm; Circluar Pins/Square Pins: 方针; Current Rating (Max): 3A; Channel ID: $1e1231; Symbol: HDR-M-2.54_1x3; Device: 77311-102-03LF; LCSC Part Name: 间距:2.54mm 直插 方针; Supplier Part: C180248; Manufacturer Part: 77311-102-03LF; Supplier Footprint: 插件,P=2.54mm; JLCPCB Part Class: Extended Part; Datasheet: https://atta.szlcsc.com/upload/public/pdf/source/20180628/C213450_5021AFFAB06BCF705334CA5527F304F1.pdf; Supplier: LCSC; Convert to PCB: yes; Pin Structure: -; Row Spacing: -; Mounting Type: 直插; Number of Rows: 单排; Number of Pins: 3P; Voltage Rating (Max): -; Length of Mating Pin: -; Insulation Height: 2.54mm; Contact Material: 磷青铜; Contact Plating: 锡; Operating Temperature Range: -65℃~+125℃; Color: 黑色; Origin Footprint: HDR-M-2.54_1X3; FootprintName: HDR-M-2.54_1X3; DeviceName: 77311-102-03LF
J2 = 77311-102-03LF: Manufacturer: Amphenol; Add into BOM: yes; Pitch: 2.54mm; Circluar Pins/Square Pins: 方针; Current Rating (Max): 3A; Channel ID: $1e1261; Symbol: HDR-M-2.54_1x3; Device: 77311-102-03LF; LCSC Part Name: 间距:2.54mm 直插 方针; Supplier Part: C180248; Manufacturer Part: 77311-102-03LF; Supplier Footprint: 插件,P=2.54mm; JLCPCB Part Class: Extended Part; Datasheet: https://atta.szlcsc.com/upload/public/pdf/source/20180628/C213450_5021AFFAB06BCF705334CA5527F304F1.pdf; Supplier: LCSC; Convert to PCB: yes; Pin Structure: -; Row Spacing: -; Mounting Type: 直插; Number of Rows: 单排; Number of Pins: 3P; Voltage Rating (Max): -; Length of Mating Pin: -; Insulation Height: 2.54mm; Contact Material: 磷青铜; Contact Plating: 锡; Operating Temperature Range: -65℃~+125℃; Color: 黑色; Origin Footprint: HDR-M-2.54_1X3; FootprintName: HDR-M-2.54_1X3; DeviceName: 77311-102-03LF
KEY1 = K2-1107ST-A4DW-06: Manufacturer: 韩国韩荣; Symbol: K2-3.6×6.1_SMD; Add into BOM: yes; Circuit: 单刀单掷; Actuator Style: 矩形按钮; Operating Force: 250gf; Switch Length: 6.1mm; Switch Width: 3.6mm; Switch Height: 2.5mm; Contact Current: 50mA; Voltage Rating (DC): 12V; Insulation Resistance: 100MΩ; Mechanical Life: 10万次; Channel ID: $1e16534; Standardization Check: false; Device: K2-1107ST-A4DW-06; LCSC Part Name: 轻触开关 3.6*6.1*2.5; Supplier Part: C118141; Manufacturer Part: K2-1107ST-A4DW-06; Supplier Footprint: SMD; JLCPCB Part Class: Extended Part; Datasheet: https://atta.szlcsc.com/upload/public/pdf/source/20210810/381712CEF248770C072B585C3485C888.pdf; Supplier: LCSC; Convert to PCB: yes; Mounting Style: 立贴; With Lamp: -; Operating Temperature: -25℃~+85℃; FootprintName: KEY-SMD_2P-L6.2-W3.6-LS8.0; DeviceName: K2-1107ST-A4DW-06
L1 = 4.7uH: Manufacturer: PSA(信昌电陶); Manufacturer Part: MCS0630-4R7MPY1; Add into BOM: yes; Symbol: 4.7uH; Device: 4.7uH; Supplier: LCSC; Supplier Part: C2937097; Convert to PCB: yes; Origin Footprint: IND-SMD_L7.3-W6.6
R1 = 0603WAF3001T5E: Manufacturer: UNI-ROYAL(厚声); Symbol: 3K/0.1%; Add into BOM: yes; Tolerance: ±1%; Power(Watts): 100mW; Overload Voltage (Max): 75V; Temperature Coefficient: ±100ppm/℃; Channel ID: $1e1357; Device: 0603WAF3001T5E; LCSC Part Name: 3kΩ ±1% 100mW 厚膜电阻; Supplier Part: C4211; Manufacturer Part: 0603WAF3001T5E; Supplier Footprint: 0603; JLCPCB Part Class: Basic Part; Datasheet: https://atta.szlcsc.com/upload/public/pdf/source/20200306/C422600_1E6D84923E4A46A82E41ADD87F860B5C.pdf; Supplier: LCSC; Convert to PCB: yes; Type: 厚膜电阻; Value: 3kΩ; Operating Temperature Range: -55℃~+155℃; FootprintName: R0603; DeviceName: 0603WAF3001T5E
R2 = 0603WAF1001T5E: Manufacturer: UNI-ROYAL(厚声); Symbol: 1k/0.1%; Add into BOM: yes; Tolerance: ±1%; Power(Watts): 100mW; Overload Voltage (Max): 75V; Temperature Coefficient: ±100ppm/℃; Channel ID: $1e1383; Device: 0603WAF1001T5E; LCSC Part Name: 1kΩ ±1% 100mW 厚膜电阻; Supplier Part: C21190; Manufacturer Part: 0603WAF1001T5E; Supplier Footprint: 0603; JLCPCB Part Class: Basic Part; Datasheet: https://atta.szlcsc.com/upload/public/pdf/source/20200306/C422600_1E6D84923E4A46A82E41ADD87F860B5C.pdf; Supplier: LCSC; Convert to PCB: yes; Type: 厚膜电阻; Value: 1kΩ; Operating Temperature Range: -55℃~+155℃; FootprintName: R0603; DeviceName: 0603WAF1001T5E
R3 = 0603WAF4701T5E: Manufacturer: UNI-ROYAL(厚声); Symbol: 4.7K; Add into BOM: yes; Tolerance: ±1%; Power(Watts): 100mW; Overload Voltage (Max): 75V; Temperature Coefficient: ±100ppm/℃; Channel ID: $1e2339; Device: 0603WAF4701T5E; LCSC Part Name: 4.7kΩ ±1% 100mW 厚膜电阻; Supplier Part: C23162; Manufacturer Part: 0603WAF4701T5E; Supplier Footprint: 0603; JLCPCB Part Class: Basic Part; Datasheet: https://atta.szlcsc.com/upload/public/pdf/source/20200306/C422600_1E6D84923E4A46A82E41ADD87F860B5C.pdf; Supplier: LCSC; Convert to PCB: yes; Type: 厚膜电阻; Value: 4.7kΩ; Operating Temperature Range: -55℃~+155℃; FootprintName: R0603; DeviceName: 0603WAF4701T5E
R5 = 0603WAF4701T5E: Manufacturer: UNI-ROYAL(厚声); Symbol: 4.7K; Add into BOM: yes; Tolerance: ±1%; Power(Watts): 100mW; Overload Voltage (Max): 75V; Temperature Coefficient: ±100ppm/℃; Channel ID: $1e2364; Device: 0603WAF4701T5E; LCSC Part Name: 4.7kΩ ±1% 100mW 厚膜电阻; Supplier Part: C23162; Manufacturer Part: 0603WAF4701T5E; Supplier Footprint: 0603; JLCPCB Part Class: Basic Part; Datasheet: https://atta.szlcsc.com/upload/public/pdf/source/20200306/C422600_1E6D84923E4A46A82E41ADD87F860B5C.pdf; Supplier: LCSC; Convert to PCB: yes; Type: 厚膜电阻; Value: 4.7kΩ; Operating Temperature Range: -55℃~+155℃; FootprintName: R0603; DeviceName: 0603WAF4701T5E
R6 = 0603WAF4701T5E: Manufacturer: UNI-ROYAL(厚声); Symbol: 4.7K; Add into BOM: yes; Tolerance: ±1%; Power(Watts): 100mW; Overload Voltage (Max): 75V; Temperature Coefficient: ±100ppm/℃; Channel ID: $1e2389; Device: 0603WAF4701T5E; LCSC Part Name: 4.7kΩ ±1% 100mW 厚膜电阻; Supplier Part: C23162; Manufacturer Part: 0603WAF4701T5E; Supplier Footprint: 0603; JLCPCB Part Class: Basic Part; Datasheet: https://atta.szlcsc.com/upload/public/pdf/source/20200306/C422600_1E6D84923E4A46A82E41ADD87F860B5C.pdf; Supplier: LCSC; Convert to PCB: yes; Type: 厚膜电阻; Value: 4.7kΩ; Operating Temperature Range: -55℃~+155℃; FootprintName: R0603; DeviceName: 0603WAF4701T5E
R7 = 0603WAF4701T5E: Manufacturer: UNI-ROYAL(厚声); Symbol: 4.7K; Add into BOM: yes; Tolerance: ±1%; Power(Watts): 100mW; Overload Voltage (Max): 75V; Temperature Coefficient: ±100ppm/℃; Channel ID: $1e2414; Device: 0603WAF4701T5E; LCSC Part Name: 4.7kΩ ±1% 100mW 厚膜电阻; Supplier Part: C23162; Manufacturer Part: 0603WAF4701T5E; Supplier Footprint: 0603; JLCPCB Part Class: Basic Part; Datasheet: https://atta.szlcsc.com/upload/public/pdf/source/20200306/C422600_1E6D84923E4A46A82E41ADD87F860B5C.pdf; Supplier: LCSC; Convert to PCB: yes; Type: 厚膜电阻; Value: 4.7kΩ; Operating Temperature Range: -55℃~+155℃; FootprintName: R0603; DeviceName: 0603WAF4701T5E
R8 = 0603WAF1003T5E: Manufacturer: UNI-ROYAL(厚声); Symbol: 100k; Add into BOM: yes; Tolerance: ±1%; Power(Watts): 100mW; Overload Voltage (Max): 75V; Temperature Coefficient: ±100ppm/℃; Channel ID: $1e2544; Device: 0603WAF1003T5E; LCSC Part Name: 100kΩ ±1% 100mW 厚膜电阻; Supplier Part: C25803; Manufacturer Part: 0603WAF1003T5E; Supplier Footprint: 0603; JLCPCB Part Class: Basic Part; Datasheet: https://atta.szlcsc.com/upload/public/pdf/source/20200306/C422600_1E6D84923E4A46A82E41ADD87F860B5C.pdf; Supplier: LCSC; Convert to PCB: yes; Type: 厚膜电阻; Value: 100kΩ; Operating Temperature Range: -55℃~+155℃; FootprintName: R0603; DeviceName: 0603WAF1003T5E
R10 = FRC0603F4022TS: Manufacturer: FOJAN(富捷); Symbol: 40.2k; Add into BOM: yes; Tolerance: ±1%; Power(Watts): 100mW; Overload Voltage (Max): 75V; Temperature Coefficient: ±100ppm/℃; Channel ID: $1e2830; Device: FRC0603F4022TS; LCSC Part Name: 40.2kΩ ±1% 100mW 厚膜电阻; Supplier Part: C2933218; Manufacturer Part: FRC0603F4022TS; Supplier Footprint: 0603; JLCPCB Part Class: Extended Part; Datasheet: https://atta.szlcsc.com/upload/public/pdf/source/20211221/925EC7D7225764EE0046F22065062C87.pdf; Supplier: LCSC; Convert to PCB: yes; Type: 厚膜电阻; Value: 40.2kΩ; Operating Temperature Range: -55℃~+155℃; FootprintName: R0603; DeviceName: FRC0603F4022TS
R12 = FRC0603F5491TS: Manufacturer: FOJAN(富捷); Symbol: 5.49k; Add into BOM: yes; Tolerance: ±1%; Power(Watts): 100mW; Overload Voltage (Max): 75V; Temperature Coefficient: ±100ppm/℃; Channel ID: $1e2855; Device: FRC0603F5491TS; LCSC Part Name: 5.49kΩ ±1% 100mW 厚膜电阻; Supplier Part: C3000723; Manufacturer Part: FRC0603F5491TS; Supplier Footprint: 0603; JLCPCB Part Class: Extended Part; Datasheet: https://atta.szlcsc.com/upload/public/pdf/source/20211221/925EC7D7225764EE0046F22065062C87.pdf; Supplier: LCSC; Convert to PCB: yes; Type: 厚膜电阻; Value: 5.49kΩ; FootprintName: R0603; DeviceName: FRC0603F5491TS
R16 = 0603WAF1004T5E: Manufacturer: UNI-ROYAL(厚声); Symbol: 1M; Add into BOM: yes; Tolerance: ±1%; Power(Watts): 100mW; Overload Voltage (Max): 75V; Temperature Coefficient: ±100ppm/℃; Channel ID: $1e29469; Device: 0603WAF1004T5E; LCSC Part Name: 1MΩ ±1% 100mW 厚膜电阻; Supplier Part: C22935; Manufacturer Part: 0603WAF1004T5E; Supplier Footprint: 0603; JLCPCB Part Class: Basic Part; Datasheet: https://atta.szlcsc.com/upload/public/pdf/source/20200306/C422600_1E6D84923E4A46A82E41ADD87F860B5C.pdf; Supplier: LCSC; Convert to PCB: yes; Type: 厚膜电阻; Value: 1MΩ; Operating Temperature Range: -55℃~+155℃; FootprintName: R0603; DeviceName: 0603WAF1004T5E
R17 = 0603WAF1002T5E: Manufacturer: UNI-ROYAL(厚声); Symbol: 10k; Add into BOM: yes; Tolerance: ±1%; Power(Watts): 100mW; Overload Voltage (Max): 75V; Temperature Coefficient: ±100ppm/℃; Channel ID: $1e29713; Device: 0603WAF1002T5E; LCSC Part Name: 厚膜电阻 10kΩ ±1% 100mW; Supplier Part: C25804; Manufacturer Part: 0603WAF1002T5E; Supplier Footprint: 0603; JLCPCB Part Class: Basic Part; Datasheet: https://atta.szlcsc.com/upload/public/pdf/source/20200306/C422600_1E6D84923E4A46A82E41ADD87F860B5C.pdf; Supplier: LCSC; Convert to PCB: yes; Type: 厚膜电阻; Value: 10kΩ; Operating Temperature Range: -55℃~+155℃; FootprintName: R0603; DeviceName: 0603WAF1002T5E
R18 = 0603WAF1002T5E: Manufacturer: UNI-ROYAL(厚声); Symbol: 10k; Add into BOM: yes; Tolerance: ±1%; Power(Watts): 100mW; Overload Voltage (Max): 75V; Temperature Coefficient: ±100ppm/℃; Channel ID: $1e30442; Device: 0603WAF1002T5E; LCSC Part Name: 厚膜电阻 10kΩ ±1% 100mW; Supplier Part: C25804; Manufacturer Part: 0603WAF1002T5E; Supplier Footprint: 0603; JLCPCB Part Class: Basic Part; Datasheet: https://atta.szlcsc.com/upload/public/pdf/source/20200306/C422600_1E6D84923E4A46A82E41ADD87F860B5C.pdf; Supplier: LCSC; Convert to PCB: yes; Type: 厚膜电阻; Value: 10kΩ; Operating Temperature Range: -55℃~+155℃; FootprintName: R0603; DeviceName: 0603WAF1002T5E
R19 = 0603WAF1002T5E: Manufacturer: UNI-ROYAL(厚声); Symbol: 10k; Add into BOM: yes; Tolerance: ±1%; Power(Watts): 100mW; Overload Voltage (Max): 75V; Temperature Coefficient: ±100ppm/℃; Channel ID: $1e30468; Device: 0603WAF1002T5E; LCSC Part Name: 厚膜电阻 10kΩ ±1% 100mW; Supplier Part: C25804; Manufacturer Part: 0603WAF1002T5E; Supplier Footprint: 0603; JLCPCB Part Class: Basic Part; Datasheet: https://atta.szlcsc.com/upload/public/pdf/source/20200306/C422600_1E6D84923E4A46A82E41ADD87F860B5C.pdf; Supplier: LCSC; Convert to PCB: yes; Type: 厚膜电阻; Value: 10kΩ; Operating Temperature Range: -55℃~+155℃; FootprintName: R0603; DeviceName: 0603WAF1002T5E
R20 = 0603WAF1002T5E: Manufacturer: UNI-ROYAL(厚声); Symbol: 10k; Add into BOM: yes; Tolerance: ±1%; Power(Watts): 100mW; Overload Voltage (Max): 75V; Temperature Coefficient: ±100ppm/℃; Channel ID: $1e30587; Device: 0603WAF1002T5E; LCSC Part Name: 厚膜电阻 10kΩ ±1% 100mW; Supplier Part: C25804; Manufacturer Part: 0603WAF1002T5E; Supplier Footprint: 0603; JLCPCB Part Class: Basic Part; Datasheet: https://atta.szlcsc.com/upload/public/pdf/source/20200306/C422600_1E6D84923E4A46A82E41ADD87F860B5C.pdf; Supplier: LCSC; Convert to PCB: yes; Type: 厚膜电阻; Value: 10kΩ; Operating Temperature Range: -55℃~+155℃; FootprintName: R0603; DeviceName: 0603WAF1002T5E
R21 = 0603WAF1002T5E: Manufacturer: UNI-ROYAL(厚声); Symbol: 10k; Add into BOM: yes; Tolerance: ±1%; Power(Watts): 100mW; Overload Voltage (Max): 75V; Temperature Coefficient: ±100ppm/℃; Channel ID: $1e30787; Device: 0603WAF1002T5E; LCSC Part Name: 厚膜电阻 10kΩ ±1% 100mW; Supplier Part: C25804; Manufacturer Part: 0603WAF1002T5E; Supplier Footprint: 0603; JLCPCB Part Class: Basic Part; Datasheet: https://atta.szlcsc.com/upload/public/pdf/source/20200306/C422600_1E6D84923E4A46A82E41ADD87F860B5C.pdf; Supplier: LCSC; Convert to PCB: yes; Type: 厚膜电阻; Value: 10kΩ; Operating Temperature Range: -55℃~+155℃; FootprintName: R0603; DeviceName: 0603WAF1002T5E
R22 = 0603WAF1002T5E: Manufacturer: UNI-ROYAL(厚声); Symbol: 10k; Add into BOM: yes; Tolerance: ±1%; Power(Watts): 100mW; Overload Voltage (Max): 75V; Temperature Coefficient: ±100ppm/℃; Channel ID: $1e30810; Device: 0603WAF1002T5E; LCSC Part Name: 厚膜电阻 10kΩ ±1% 100mW; Supplier Part: C25804; Manufacturer Part: 0603WAF1002T5E; Supplier Footprint: 0603; JLCPCB Part Class: Basic Part; Datasheet: https://atta.szlcsc.com/upload/public/pdf/source/20200306/C422600_1E6D84923E4A46A82E41ADD87F860B5C.pdf; Supplier: LCSC; Convert to PCB: yes; Type: 厚膜电阻; Value: 10kΩ; Operating Temperature Range: -55℃~+155℃; FootprintName: R0603; DeviceName: 0603WAF1002T5E
R23 = 0603WAF1002T5E: Manufacturer: UNI-ROYAL(厚声); Symbol: 10k; Add into BOM: yes; Tolerance: ±1%; Power(Watts): 100mW; Overload Voltage (Max): 75V; Temperature Coefficient: ±100ppm/℃; Channel ID: $1e30836; Device: 0603WAF1002T5E; LCSC Part Name: 厚膜电阻 10kΩ ±1% 100mW; Supplier Part: C25804; Manufacturer Part: 0603WAF1002T5E; Supplier Footprint: 0603; JLCPCB Part Class: Basic Part; Datasheet: https://atta.szlcsc.com/upload/public/pdf/source/20200306/C422600_1E6D84923E4A46A82E41ADD87F860B5C.pdf; Supplier: LCSC; Convert to PCB: yes; Type: 厚膜电阻; Value: 10kΩ; Operating Temperature Range: -55℃~+155℃; FootprintName: R0603; DeviceName: 0603WAF1002T5E
U3 = AMS1117-3.3_C347222: Manufacturer: UMW(友台半导体); Add into BOM: yes; Output Type: 固定; Maximum Input Voltage: 12V; Output Voltage: 3.3V; Output Current: 1A; Power Supply Rejection Ratio (PSRR): 60dB@(120Hz); Dropout Voltage: 1.3V@(1A); Output Polarity: 正极; Number of Outputs: 1; Channel ID: $1e2185; Standardization Check: false; Symbol: AMS1117-3.3; Device: AMS1117-3.3_C347222; LCSC Part Name: 输出:3.3V 电流:1A 耐压:12V; Supplier Part: C347222; Manufacturer Part: AMS1117-3.3; Supplier Footprint: SOT-223; JLCPCB Part Class: Extended Part; Datasheet: https://atta.szlcsc.com/upload/public/pdf/source/20241218/BAF0263FA2E44BCD8AF41AA4FA04EFAA.pdf; Supplier: LCSC; Convert to PCB: yes; standby current: -; Noise: -; Feature: 过流保护(OCP); Operating Temperature: -; FootprintName: SOT-223_L6.7-W3.5-P2.30-BR; DeviceName: AMS1117-3.3_C347222
U4 = MP2225GJ-Z_C133066: Manufacturer: MPS(芯源); Add into BOM: yes; Function: 降压型; Output Type: 可调; Input Voltage: 4.5V~18V; Output Current: 5A; Switching Frequency: 500kHz; Synchronous Rectification: 是; Number of Outputs: 1; Topology: 降压式; Quiescent Current (Iq): 400uA; Switch tube (built-in/external): 内置; Channel ID: $1e2499; Symbol: MP2225GJ-Z; Device: MP2225GJ-Z_C133066; LCSC Part Name: 高效率5A 18V同步降压转换器; Supplier Part: C133066; Manufacturer Part: MP2225GJ-Z; Supplier Footprint: TSOT-23-8; JLCPCB Part Class: Extended Part; Datasheet: https://atta.szlcsc.com/upload/public/pdf/source/20240315/DE01001F1E5BE5D21C887012CE3070B7.pdf; Supplier: LCSC; Convert to PCB: yes; Output Voltage: -; Operating Temperature: -40℃~+125℃; FootprintName: TSOT-23-8_L2.9-W1.6-P0.65-LS2.8-BR; DeviceName: MP2225GJ-Z_C133066
U5 = SN74HC126PWR: Manufacturer: TI(德州仪器); Add into BOM: yes; output type: 三态; Supply Voltage: 2V~6V; Number of Elements: 4; Number of Bits per Element: 1; Sink Current: 7.8mA; Logic Family: 74HC; Symbol: SN74HC126PWR; Device: SN74HC126PWR; LCSC Part Name: SN74HC126PWR; Supplier Part: C507234; Manufacturer Part: SN74HC126PWR; Supplier Footprint: TSSOP-14; JLCPCB Part Class: 扩展库; Datasheet: https://www.ti.com/cn/lit/gpn/sn74hc126; Supplier: LCSC; Convert to PCB: yes; Input type: -; Source Current: 7.8mA; Operating Temperature: -40℃~+85℃
U6 = L6234PD013TR: Manufacturer: ST(意法半导体); Add into BOM: yes; Channel ID: $1e1591; Symbol: L6234PD013TR; Device: L6234PD013TR; LCSC Part Name: 4A 无刷直流BLDC电机驱动芯片 52V; Supplier Part: C77581; Manufacturer Part: L6234PD013TR; Supplier Footprint: SOIC-20-EP-11mm; JLCPCB Part Class: Extended Part; Datasheet: https://atta.szlcsc.com/upload/public/pdf/source/20160702/1467448307879.pdf; Supplier: LCSC; Convert to PCB: yes; FootprintName: POWERSO20_L15.9-W11.0-P1.27-LS14.2-BL-EP; DeviceName: L6234PD013TR
U7 = L6234PD013TR: Manufacturer: ST(意法半导体); Add into BOM: yes; Channel ID: $1e1674; Symbol: L6234PD013TR; Device: L6234PD013TR; LCSC Part Name: 4A 无刷直流BLDC电机驱动芯片 52V; Supplier Part: C77581; Manufacturer Part: L6234PD013TR; Supplier Footprint: SOIC-20-EP-11mm; JLCPCB Part Class: Extended Part; Datasheet: https://atta.szlcsc.com/upload/public/pdf/source/20160702/1467448307879.pdf; Supplier: LCSC; Convert to PCB: yes; FootprintName: POWERSO20_L15.9-W11.0-P1.27-LS14.2-BL-EP; DeviceName: L6234PD013TR
U8 = STM32F407VGT6: Manufacturer: ST(意法半导体); Add into BOM: yes; CPU Core: ARM-M4; Program Storage Size: 1MB; RAM Size: 192KB; GPIO Ports Number: 82; Operating Voltage Range: 1.8V~3.6V; CPU Maximum Speed: 168MHz; Program Memory Type: FLASH; ADC (Bit): 12bit; Universal Serial Bus: 有; Peripheral/Function: DMA；LCD/LED驱动; Symbol: STM32F407VGT6; Device: STM32F407VGT6; LCSC Part Name: 带DSP和FPU的高性能基础系列ARM Cortex-M4 MCU，具有1 MB Flash、168 MHz CPU、ART加速器、以太网和FSMC; Supplier Part: C12345; Manufacturer Part: STM32F407VGT6; Supplier Footprint: LQFP-100(14x14); JLCPCB Part Class: 扩展库; Datasheet: https://atta.szlcsc.com/upload/public/pdf/source/20201130/C919362_39400D478C258148B3DF984CE4A4041A.pdf; Supplier: LCSC; Convert to PCB: yes; Operating Temperature Range: -40℃~+85℃; DAC (Bit): 12bit; PWM (Bit): -; Internal Comparator: -; communication protocol: -; Watchdog: 有; Real-Time Clock: -; Infrared Data Association: 有; Low-Voltage Detect: 有; CCP Capture/Compare: -; LCD Module: 有; Secure Digital Input and Output: -; Direct Memory Access: 有; Internal Oscillator: 有
U9 U10 = YLED0603R: Manufacturer: YONGYUTAI(永裕泰); Add into BOM: yes; Emitted Color: 红色; Forward Voltage (VF): 1.8V~2.4V; Forward Current: 25mA; Dominant Wavelength: 620nm~625nm; Symbol: YLED0603R; Device: YLED0603R; LCSC Part Name: YLED0603R; Supplier Part: C19171390; Manufacturer Part: YLED0603R; Supplier Footprint: 0603; JLCPCB Part Class: 扩展库; Datasheet: https://atta.szlcsc.com/upload/public/pdf/source/20231027/FB19AF06E2C70028E58AB5CEDD1BDC72.pdf; Supplier: LCSC; Convert to PCB: yes; Power Dissipation: -; Peak Wavelength: -; Diode Configuration: -; Lens Color: -; Color Temperature: -; Luminous Intensity: -; Viewing Angle: -; Mounting Sytle: -; Operating Temperature: -40℃~+85℃
X2 = X50328MSB2GI: Manufacturer: YXC(扬兴晶振); Add into BOM: yes; Crystal Type: 贴片晶振; Normal temperature Frequency Tolerance: ±10ppm; Load Capacitor: 20pF; Frequency Stability: ±20ppm; Symbol: 8MHz; Device: X50328MSB2GI; LCSC Part Name: 8MHz ±10ppm 20pF; Supplier Part: C115962; Manufacturer Part: X50328MSB2GI; Supplier Footprint: SMD5032; JLCPCB Part Class: Basic Part; Datasheet: https://atta.szlcsc.com/upload/public/pdf/source/20240329/44922B0AF7B60E58E9B66993B6077277.pdf; Supplier: LCSC; Convert to PCB: yes; Value: 8MHz; Operating Temperature: -40℃~+85℃